# Altium schematic sheet power.SCHDOC: Power Suplies
size A4; Organization: Berne University of Applied Science; Address1: School of Engineering and; Address2: Information Technology; Address3: Quellgasse 21; Address4: CH-2501 Biel; Revision: 1.0; SheetNumber: 6; SheetTotal: 19; ApprovedBy: zem1; Author: zac1
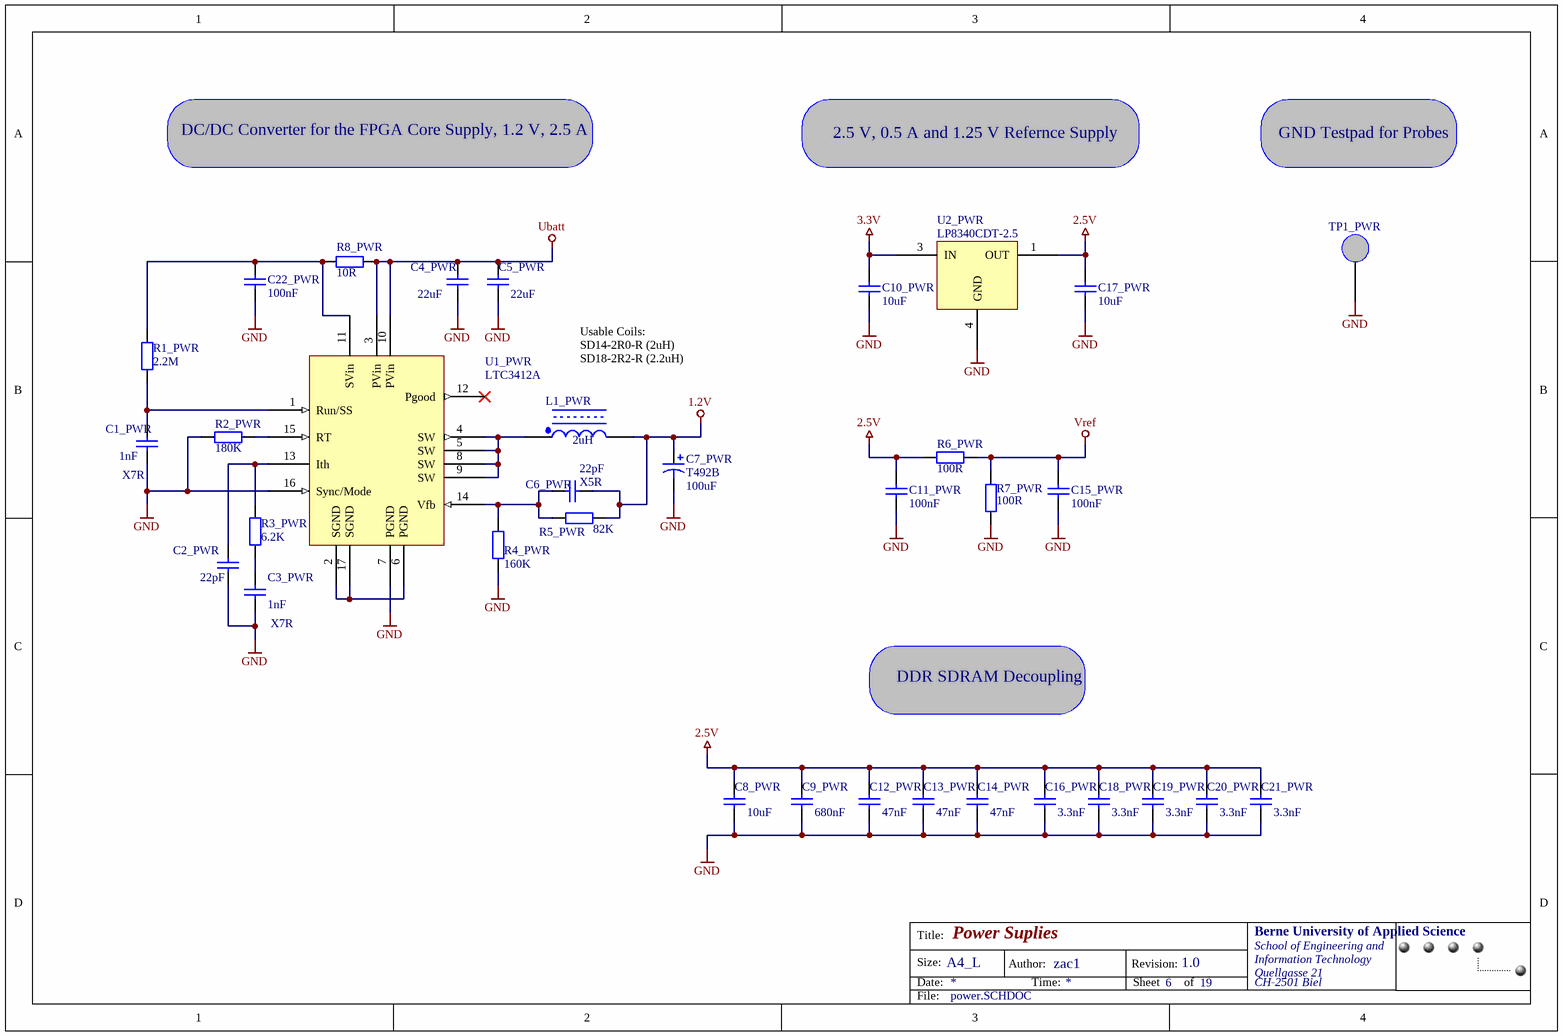
[diagram p0: power.SCHDOC]

## Parts
C1_PWR  value 1nF  Spec: X7R  [0402]  (hidden comment: Cap)
C2_PWR  value 22pF  [0402]  (hidden comment: Cap)
C3_PWR  value 1nF  Spec: X7R  [0402]  (hidden comment: Cap)
C4_PWR  value 22uF  [CC3225-1210]  (hidden comment: Cap)
C5_PWR  value 22uF  [1210]  (hidden comment: Cap)
C6_PWR  value 22pF  Spec: X5R  [0402]  (hidden comment: Cap)
C7_PWR  T492B  value 100uF  [B]
C8_PWR  value 10uF  [1206]  (hidden comment: Cap)
C9_PWR  value 680nF  [0805]  (hidden comment: Cap)
C10_PWR  value 10uF  [1206]  (hidden comment: Cap)
C11_PWR  value 100nF  [0402]  (hidden comment: Cap)
C12_PWR  value 47nF  [0402]  (hidden comment: Cap)
C13_PWR  value 47nF  [0402]  (hidden comment: Cap)
C14_PWR  value 47nF  [0402]  (hidden comment: Cap)
C15_PWR  value 100nF  [0402]  (hidden comment: Cap)
C16_PWR  value 3.3nF  [0402]  (hidden comment: Cap)
C17_PWR  value 10uF  [1206]  (hidden comment: Cap)
C18_PWR  value 3.3nF  [0402]  (hidden comment: Cap)
C19_PWR  value 3.3nF  [0402]  (hidden comment: Cap)
C20_PWR  value 3.3nF  [0402]  (hidden comment: Cap)
C21_PWR  value 3.3nF  [0402]  (hidden comment: Cap)
C22_PWR  value 100nF  [0402]  (hidden comment: Cap)
L1_PWR  2uH  [coil-sd-serie]
R1_PWR  value 2.2M  [0402]  (hidden comment: Res2)
R2_PWR  value 180K  [0402]  (hidden comment: Res2)
R3_PWR  value 6.2K  [0603]  (hidden comment: Res2)
R4_PWR  value 160K  [0603]  (hidden comment: Res2)
R5_PWR  value 82K  [0402]  (hidden comment: Res2)
R6_PWR  value 100R  [0402]  (hidden comment: Res2)
R7_PWR  value 100R  [0402]  (hidden comment: Res2)
R8_PWR  value 10R  [0402]  (hidden comment: Res2)
TP1_PWR  TESTPAD-SMD  [TESTPAD-SMD]  (value not drawn)
U1_PWR  LTC3412A  [QFN16]
U2_PWR  value LP8340CDT-2.5  [TO-252]  (hidden comment: LP8340CDT)

## Nets
1.2V: C6_PWR.1 C7_PWR.1 L1_PWR.2 R5_PWR.1
2.5V: C8_PWR.1 C9_PWR.1 C11_PWR.2 C12_PWR.1 C13_PWR.1 C14_PWR.1 C16_PWR.1 C17_PWR.2 C18_PWR.1 C19_PWR.1 C20_PWR.1 C21_PWR.1 R6_PWR.2 U2_PWR.1(OUT)
3.3V: C10_PWR.2 U2_PWR.3(IN)
GND: C1_PWR.1 C2_PWR.1 C3_PWR.1 C4_PWR.1 C5_PWR.1 C7_PWR.2 C8_PWR.2 C9_PWR.2 C10_PWR.1 C11_PWR.1 C12_PWR.2 C13_PWR.2 C14_PWR.2 C15_PWR.1 C16_PWR.2 C17_PWR.1 C18_PWR.2 C19_PWR.2 C20_PWR.2 C21_PWR.2 C22_PWR.2 R2_PWR.2 R4_PWR.1 R7_PWR.1 TP1_PWR.1 U1_PWR.7(PGND) U1_PWR.16(Sync/Mode) U2_PWR.4(GND)
Ubatt: C4_PWR.2 C5_PWR.2 R8_PWR.1 U1_PWR.3(PVin) U1_PWR.10(PVin)
Vref: C15_PWR.2 R6_PWR.1 R7_PWR.2
NetC1_PWR_2: C1_PWR.2 R1_PWR.1 U1_PWR.1(Run/SS)
NetC2_PWR_2: C2_PWR.2 R3_PWR.1 U1_PWR.13(Ith)
NetC3_PWR_2: C3_PWR.2 R3_PWR.2
NetC6_PWR_2: C6_PWR.2 R4_PWR.2 R5_PWR.2 U1_PWR.14(Vfb)
NetC22_PWR_1: C22_PWR.1 R1_PWR.2 R8_PWR.2 U1_PWR.11(SVin)
NetL1_PWR_1: L1_PWR.1 U1_PWR.4(SW) U1_PWR.5(SW) U1_PWR.8(SW) U1_PWR.9(SW)
NetR2_PWR_1: R2_PWR.1 U1_PWR.15(RT)
NetU1_PWR_2: U1_PWR.2(SGND) U1_PWR.6(PGND) U1_PWR.17(SGND)

Not connected (* = marked no-connect by the designer): U1_PWR 12(Pgood)*

## Notes on the sheet
- DC/DC Converter for the FPGA Core Supply, 1.2 V, 2.5 A
- 2.5 V, 0.5 A and 1.25 V Refernce Supply
- GND Testpad for Probes
- Usable Coils:
  SD14-2R0-R (2uH)
  SD18-2R2-R (2.2uH)
- DDR SDRAM Decoupling
- Title:
- Size:
- Date:
- A4_L
- Author:
- Time:
- Revision:
- Sheet
- of
- File:

## Library data of the parts
C1_PWR C3_PWR = Cap: Capacitor; Manufacturer: PHYCOMP; Part Number: 2238 587 15623; Class I: Passive; Currency: CHF; Packaging unit: 10; Prize: 0.11; Published: 8-Jun-2000; Revision: July-2002: Re-released for DXP Platform.; Publisher: Altium Limited; Class II: Capacitor; Distributor Number: 3019 380; RoHS: yes; Distributor: Farnell
C2_PWR C6_PWR = Cap: Capacitor; Manufacturer: Murata; Part Number: GRM1555C1H220JZ01D; Class I: Passive; Currency: CHF; Packaging unit: 10; Prize: 0.07; Published: 8-Jun-2000; Revision: July-2002: Re-released for DXP Platform.; Publisher: Altium Limited; Class II: Capacitor; Distributor Number: 8819 629; RoHS: yes; Distributor: Farnell
C4_PWR C5_PWR = Cap: Capacitor; Manufacturer: Yuden; Part Number: EMK325BJ226MM-T; Class I: Passive; Currency: CHF; Packaging unit: 1; Prize: 0.67; lead time: 14 Tage; Published: 8-Jun-2000; Revision: July-2002: Re-released for DXP Platform.; Publisher: Altium Limited; Class II: Capacitor; Distributor Number: 6578 950; RoHS: yes; Distributor: Farnell
C7_PWR = T492B: Solid Tantalum Chip Capacitor, T492 Series - CWR11 Style Per Mil-PRF-55365/8; Manufacturer: AVX; Part Number: TCJB107M004R0070; Currency: CHF; Packaging unit: 1; Prize: 0.98; Published: 17-Jul-2002; LatestRevisionDate: 19-Mar-2004; LatestRevisionNote: Silkscreen dimensions re-sized.; DatasheetDocument: Mar-2001; PackageDocument: Mar-2001; PackageReference: B; Publisher: Altium Limited; Code_JEITA: 3528-21; ComponentLink1Description: Manufacturer Link; ComponentLink1URL: http://www.kemet.com/; ComponentLink2Description: Datasheet; ComponentLink2URL: http://www.kemet.com/kemet/web/homepage/kechome.nsf/vapubfilesname/F3102TA.pdf/$file/F3102TA.pdf; Distributor Number: 1135 228; RoHS: yes; Distributor: Farnell
C8_PWR C10_PWR C17_PWR = Cap: Capacitor; Manufacturer: Murata; Part Number: GRM31CR70J106KA01L; Class I: Passive; Currency: CHF; Packaging unit: 1; Prize: 0.25; Published: 8-Jun-2000; Revision: July-2002: Re-released for DXP Platform.; Publisher: Altium Limited; Class II: Capacitor; Distributor Number: 9527 729; RoHS: yes; Distributor: Farnell
C9_PWR = Cap: Capacitor; Manufacturer: PHYCOMP; Part Number: 2238 240 15661; Class I: Passive; Currency: CHF; Packaging unit: 10; Prize: 0.34; Published: 8-Jun-2000; Revision: July-2002: Re-released for DXP Platform.; Publisher: Altium Limited; Class II: Capacitor; Distributor Number: 3352 055; RoHS: yes; Distributor: Farnell
C11_PWR C15_PWR C22_PWR = Cap: Capacitor; Manufacturer: Murata; Part Number: GRM155R71C104KA88D; Class I: Passive; Currency: CHF; Packaging unit: 10; Prize: 0.07; Published: 8-Jun-2000; Revision: July-2002: Re-released for DXP Platform.; Publisher: Altium Limited; Class II: Capacitor; Distributor Number: 8819 742; RoHS: yes; Distributor: Farnell
C12_PWR C13_PWR C14_PWR = Cap: Capacitor; Manufacturer: PHYCOMP; Part Number: 2238 787 19845; Class I: Passive; Currency: CHF; Packaging unit: 10; Prize: 0.15; Published: 8-Jun-2000; Revision: July-2002: Re-released for DXP Platform.; Publisher: Altium Limited; Class II: Capacitor; Distributor Number: 3019 469; RoHS: yes; Distributor: Farnell
C16_PWR C18_PWR C19_PWR C20_PWR C21_PWR = Cap: Capacitor; Manufacturer: PHYCOMP; Part Number: 2238 587 15629; Class I: Passive; Currency: CHF; Packaging unit: 10; Prize: 0.11; Published: 8-Jun-2000; Revision: July-2002: Re-released for DXP Platform.; Publisher: Altium Limited; Class II: Capacitor; Distributor Number: 3019 410; RoHS: yes; Distributor: Farnell
L1_PWR = COIL-SD-SERIE: SD Series Coils from Coiltronics; Manufacturer: Cooper Bussmann; Part Number: SD14-2R0-R; Currency: CHF; lead time: 10 Days; Packaging unit: 3800; Prize: 1.85; Value: 2uH; RoHS: yes; Distributor: Hy-Line
R1_PWR = Res2: Resistor; Manufacturer: PHYCOMP; Part Number: 232270672205; Class I: Passive; Currency: CHF; Packaging unit: 50; Prize: 0.12; Published: 8-Jun-2000; Revision: July-2002: Re-released for DXP Platform.; Publisher: Altium Limited; Class II: Resistor; Distributor Number: 9239618; RoHS: yes; Distributor: Farnell
R2_PWR = Res2: Resistor; Manufacturer: PHYCOMP; Part Number: 232270671804; Class I: Passive; Currency: CHF; Packaging unit: 50; Prize: 0.12; Published: 8-Jun-2000; Revision: July-2002: Re-released for DXP Platform.; Publisher: Altium Limited; Class II: Resistor; Distributor Number: 9239502; RoHS: yes; Distributor: Farnell
R3_PWR = Res2: Resistor; Manufacturer: Multicomp; Part Number: MC 0.063W 0603 1% 6K2; Class I: Passive; Currency: CHF; Packaging unit: 50; Prize: 0.055; Published: 8-Jun-2000; Revision: July-2002: Re-released for DXP Platform.; Publisher: Altium Limited; Class II: Resistor; Distributor Number: 9331409; RoHS: X-yes; Distributor: Farnell
R4_PWR = Res2: Resistor; Manufacturer: Multicomp; Part Number: MC 0.063W 0603 1% 160K; Class I: Passive; Currency: CHF; Packaging unit: 50; Prize: 0.055; Published: 8-Jun-2000; Revision: July-2002: Re-released for DXP Platform.; Publisher: Altium Limited; Class II: Resistor; Distributor Number: 9330682; RoHS: X-yes; Distributor: Farnell
R5_PWR = Res2: Resistor; Manufacturer: PHYCOMP; Part Number: 232270678203; Class I: Passive; Currency: CHF; Packaging unit: 50; Prize: 0.12; Published: 8-Jun-2000; Revision: July-2002: Re-released for DXP Platform.; Publisher: Altium Limited; Class II: Resistor; Distributor Number: 9239464; RoHS: yes; Distributor: Farnell
R6_PWR R7_PWR = Res2: Resistor; Manufacturer: PHYCOMP; Part Number: 232270671001; Class I: Passive; Currency: CHF; Packaging unit: 50; Prize: 0.12; Published: 8-Jun-2000; Revision: July-2002: Re-released for DXP Platform.; Publisher: Altium Limited; Class II: Resistor; Distributor Number: 9239111; RoHS: yes; Distributor: Farnell
R8_PWR = Res2: Resistor; Manufacturer: TYCO ELECTRONICS; Part Number: CRG0402J10R-10; Class I: Passive; Currency: CHF; Packaging unit: 50; Prize: 0.09; Published: 8-Jun-2000; Revision: July-2002: Re-released for DXP Platform.; Publisher: Altium Limited; Class II: Resistor; Distributor Number: 1174141; RoHS: yes; Distributor: Farnell
TP1_PWR = TESTPAD-SMD: Harwin SMD Testpad; Value: S1751-46R; Currency: CHF; Packaging unit: 100; Prize: 0.1895; Distributor Number: 1022 338; Manufacturer: HARWIN; Part Number: S1751-46R; RoHS: yes; Distributor: Farnell
U1_PWR = LTC3412A: 3 A, 4 MHz, Step-Down Regulator; Manufacturer: Linear; Part Number: LTC3412AEUF#PBF; Currency: $; Packaging unit: 1; Prize: 4.93; lead time: 2 Weeks; Value: LTC3412A; Distributor Number: LTC3412AEUF#PBF; RoHS: yes; Distributor: Linear online
U2_PWR = LP8340CDT: Low Dropout, Low IQ, 1.0A CMOS Linear Regulator; Manufacturer: National; Currency: CHF; Packaging unit: 75; Prize: 1.065; lead time: 6 Weeks; Part Number: LP8340CDT-2.5; RoHS: yes; Distributor: EBV; Distributor Number: LP8340CDT-2.5/NOPB